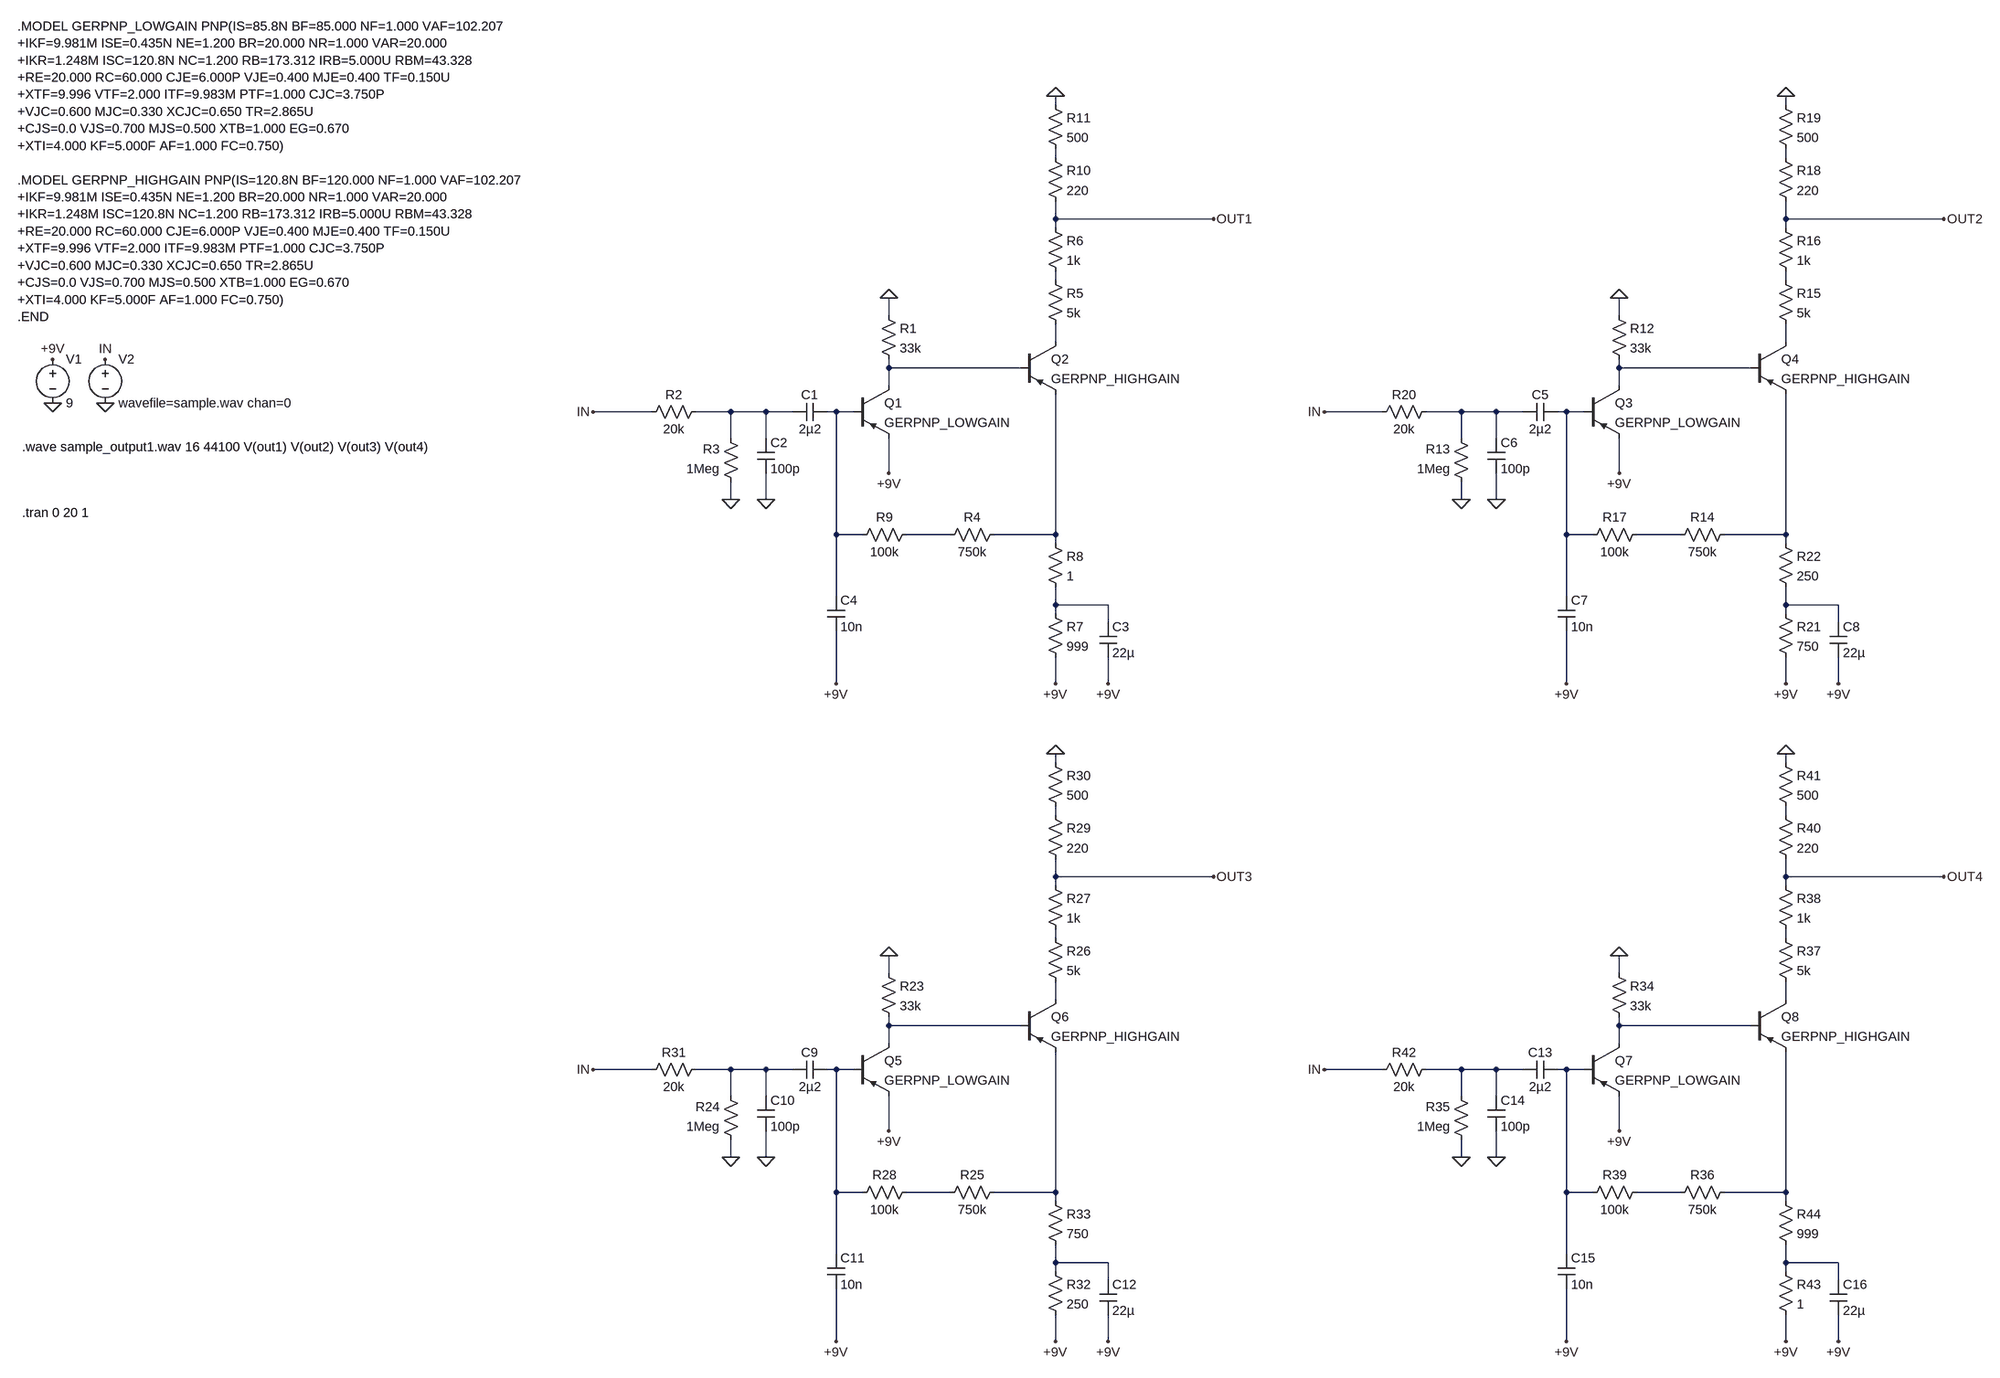
[diagram p0: schematic PNP_Fuzz_Simulation_wav_in_out.asc]
PNP_Fuzz_Simulation_wav_in_out.asc, the LTspice schematic file:
Version 4
SHEET 1 2256 2076
WIRE 496 -320 496 -336
WIRE 1888 -320 1888 -336
WIRE 496 -224 496 -240
WIRE 1888 -224 1888 -240
WIRE 496 -112 496 -144
WIRE 784 -112 496 -112
WIRE 1888 -112 1888 -144
WIRE 2176 -112 1888 -112
WIRE 496 -96 496 -112
WIRE 1888 -96 1888 -112
WIRE 496 0 496 -16
WIRE 1888 0 1888 -16
WIRE 192 64 192 32
WIRE 1584 64 1584 32
WIRE 496 112 496 80
WIRE 1888 112 1888 80
WIRE 192 160 192 144
WIRE 432 160 192 160
WIRE 1584 160 1584 144
WIRE 1824 160 1584 160
WIRE 192 192 192 160
WIRE 1584 192 1584 160
WIRE -240 240 -384 240
WIRE -96 240 -160 240
WIRE -32 240 -96 240
WIRE 16 240 -32 240
WIRE 96 240 80 240
WIRE 128 240 96 240
WIRE 1152 240 1008 240
WIRE 1296 240 1232 240
WIRE 1360 240 1296 240
WIRE 1408 240 1360 240
WIRE 1488 240 1472 240
WIRE 1520 240 1488 240
WIRE -96 288 -96 240
WIRE -32 288 -32 240
WIRE 1296 288 1296 240
WIRE 1360 288 1360 240
WIRE 192 352 192 288
WIRE 1584 352 1584 288
WIRE -96 400 -96 368
WIRE -32 400 -32 352
WIRE 1296 400 1296 368
WIRE 1360 400 1360 352
WIRE 96 464 96 240
WIRE 144 464 96 464
WIRE 304 464 224 464
WIRE 496 464 496 208
WIRE 496 464 384 464
WIRE 1488 464 1488 240
WIRE 1536 464 1488 464
WIRE 1696 464 1616 464
WIRE 1888 464 1888 208
WIRE 1888 464 1776 464
WIRE 496 480 496 464
WIRE 1888 480 1888 464
WIRE 96 576 96 464
WIRE 1488 576 1488 464
WIRE 496 592 496 560
WIRE 592 592 496 592
WIRE 1888 592 1888 560
WIRE 1984 592 1888 592
WIRE 496 608 496 592
WIRE 1888 608 1888 592
WIRE 592 624 592 592
WIRE 1984 624 1984 592
WIRE 96 736 96 640
WIRE 496 736 496 688
WIRE 592 736 592 688
WIRE 1488 736 1488 640
WIRE 1888 736 1888 688
WIRE 1984 736 1984 688
WIRE 496 880 496 864
WIRE 1888 880 1888 864
WIRE 496 976 496 960
WIRE 1888 976 1888 960
WIRE 496 1088 496 1056
WIRE 784 1088 496 1088
WIRE 1888 1088 1888 1056
WIRE 2176 1088 1888 1088
WIRE 496 1104 496 1088
WIRE 1888 1104 1888 1088
WIRE 496 1200 496 1184
WIRE 1888 1200 1888 1184
WIRE 192 1264 192 1232
WIRE 1584 1264 1584 1232
WIRE 496 1312 496 1280
WIRE 1888 1312 1888 1280
WIRE 192 1360 192 1344
WIRE 432 1360 192 1360
WIRE 1584 1360 1584 1344
WIRE 1824 1360 1584 1360
WIRE 192 1392 192 1360
WIRE 1584 1392 1584 1360
WIRE -240 1440 -384 1440
WIRE -96 1440 -160 1440
WIRE -32 1440 -96 1440
WIRE 16 1440 -32 1440
WIRE 96 1440 80 1440
WIRE 128 1440 96 1440
WIRE 1152 1440 1008 1440
WIRE 1296 1440 1232 1440
WIRE 1360 1440 1296 1440
WIRE 1408 1440 1360 1440
WIRE 1488 1440 1472 1440
WIRE 1520 1440 1488 1440
WIRE -96 1488 -96 1440
WIRE -32 1488 -32 1440
WIRE 1296 1488 1296 1440
WIRE 1360 1488 1360 1440
WIRE 192 1552 192 1488
WIRE 1584 1552 1584 1488
WIRE -96 1600 -96 1568
WIRE -32 1600 -32 1552
WIRE 1296 1600 1296 1568
WIRE 1360 1600 1360 1552
WIRE 96 1664 96 1440
WIRE 144 1664 96 1664
WIRE 304 1664 224 1664
WIRE 496 1664 496 1408
WIRE 496 1664 384 1664
WIRE 1488 1664 1488 1440
WIRE 1536 1664 1488 1664
WIRE 1696 1664 1616 1664
WIRE 1888 1664 1888 1408
WIRE 1888 1664 1776 1664
WIRE 496 1680 496 1664
WIRE 1888 1680 1888 1664
WIRE 96 1776 96 1664
WIRE 1488 1776 1488 1664
WIRE 496 1792 496 1760
WIRE 592 1792 496 1792
WIRE 1888 1792 1888 1760
WIRE 1984 1792 1888 1792
WIRE 496 1808 496 1792
WIRE 1888 1808 1888 1792
WIRE 592 1824 592 1792
WIRE 1984 1824 1984 1792
WIRE 96 1936 96 1840
WIRE 496 1936 496 1888
WIRE 592 1936 592 1888
WIRE 1488 1936 1488 1840
WIRE 1888 1936 1888 1888
WIRE 1984 1936 1984 1888
FLAG 192 32 0
FLAG -384 240 IN
FLAG 192 352 +9V
FLAG -96 400 0
FLAG -1648 224 0
FLAG -1552 224 0
FLAG -1648 144 +9V
FLAG -1552 144 IN
FLAG -32 400 0
FLAG 496 736 +9V
FLAG 592 736 +9V
FLAG 784 -112 OUT1
FLAG 496 -336 0
FLAG 96 736 +9V
FLAG 1584 32 0
FLAG 1008 240 IN
FLAG 1584 352 +9V
FLAG 1296 400 0
FLAG 1360 400 0
FLAG 1888 736 +9V
FLAG 1984 736 +9V
FLAG 2176 -112 OUT2
FLAG 1888 -336 0
FLAG 1488 736 +9V
FLAG 192 1232 0
FLAG -384 1440 IN
FLAG 192 1552 +9V
FLAG -96 1600 0
FLAG -32 1600 0
FLAG 496 1936 +9V
FLAG 592 1936 +9V
FLAG 784 1088 OUT3
FLAG 496 864 0
FLAG 96 1936 +9V
FLAG 1584 1232 0
FLAG 1008 1440 IN
FLAG 1584 1552 +9V
FLAG 1296 1600 0
FLAG 1360 1600 0
FLAG 1888 1936 +9V
FLAG 1984 1936 +9V
FLAG 2176 1088 OUT4
FLAG 1888 864 0
FLAG 1488 1936 +9V
SYMBOL res 176 48 R0
SYMATTR InstName R1
SYMATTR Value 33k
SYMBOL res -80 384 R180
WINDOW 0 36 76 Left 2
WINDOW 3 36 40 Left 2
SYMATTR InstName R3
SYMATTR Value 1Meg
SYMBOL voltage -1648 128 R0
WINDOW 123 0 0 Left 0
WINDOW 39 0 0 Left 0
SYMATTR InstName V1
SYMATTR Value 9
SYMBOL voltage -1552 128 R0
WINDOW 123 0 0 Left 0
WINDOW 39 0 0 Left 0
SYMATTR InstName V2
SYMATTR Value wavefile=sample.wav chan=0
SYMBOL pnp 128 192 R0
SYMATTR InstName Q1
SYMATTR Value GERPNP_LOWGAIN
SYMBOL cap 80 224 R90
WINDOW 0 0 32 VBottom 2
WINDOW 3 32 32 VTop 2
SYMATTR InstName C1
SYMATTR Value 2µ2
SYMBOL cap -48 288 R0
SYMATTR InstName C2
SYMATTR Value 100p
SYMBOL res 400 448 R90
WINDOW 0 0 56 VBottom 2
WINDOW 3 32 56 VTop 2
SYMATTR InstName R4
SYMATTR Value 750k
SYMBOL res 480 -16 R0
SYMATTR InstName R5
SYMATTR Value 5k
SYMBOL res 480 -112 R0
SYMATTR InstName R6
SYMATTR Value 1k
SYMBOL res 240 448 R90
WINDOW 0 0 56 VBottom 2
WINDOW 3 32 56 VTop 2
SYMATTR InstName R9
SYMATTR Value 100k
SYMBOL res 480 -240 R0
SYMATTR InstName R10
SYMATTR Value 220
SYMBOL res 480 -336 R0
SYMATTR InstName R11
SYMATTR Value 500
SYMBOL pnp 432 112 R0
SYMATTR InstName Q2
SYMATTR Value GERPNP_HIGHGAIN
SYMBOL res -144 224 R90
WINDOW 0 0 56 VBottom 2
WINDOW 3 32 56 VTop 2
SYMATTR InstName R2
SYMATTR Value 20k
SYMBOL cap 80 576 R0
SYMATTR InstName C4
SYMATTR Value 10n
SYMBOL cap 576 624 R0
SYMATTR InstName C3
SYMATTR Value 22µ
SYMBOL res 480 592 R0
SYMATTR InstName R7
SYMATTR Value 999
SYMBOL res 480 464 R0
SYMATTR InstName R8
SYMATTR Value 1
SYMBOL res 1568 48 R0
SYMATTR InstName R12
SYMATTR Value 33k
SYMBOL res 1312 384 R180
WINDOW 0 36 76 Left 2
WINDOW 3 36 40 Left 2
SYMATTR InstName R13
SYMATTR Value 1Meg
SYMBOL pnp 1520 192 R0
SYMATTR InstName Q3
SYMATTR Value GERPNP_LOWGAIN
SYMBOL cap 1472 224 R90
WINDOW 0 0 32 VBottom 2
WINDOW 3 32 32 VTop 2
SYMATTR InstName C5
SYMATTR Value 2µ2
SYMBOL cap 1344 288 R0
SYMATTR InstName C6
SYMATTR Value 100p
SYMBOL res 1792 448 R90
WINDOW 0 0 56 VBottom 2
WINDOW 3 32 56 VTop 2
SYMATTR InstName R14
SYMATTR Value 750k
SYMBOL res 1872 -16 R0
SYMATTR InstName R15
SYMATTR Value 5k
SYMBOL res 1872 -112 R0
SYMATTR InstName R16
SYMATTR Value 1k
SYMBOL res 1632 448 R90
WINDOW 0 0 56 VBottom 2
WINDOW 3 32 56 VTop 2
SYMATTR InstName R17
SYMATTR Value 100k
SYMBOL res 1872 -240 R0
SYMATTR InstName R18
SYMATTR Value 220
SYMBOL res 1872 -336 R0
SYMATTR InstName R19
SYMATTR Value 500
SYMBOL pnp 1824 112 R0
SYMATTR InstName Q4
SYMATTR Value GERPNP_HIGHGAIN
SYMBOL res 1248 224 R90
WINDOW 0 0 56 VBottom 2
WINDOW 3 32 56 VTop 2
SYMATTR InstName R20
SYMATTR Value 20k
SYMBOL cap 1472 576 R0
SYMATTR InstName C7
SYMATTR Value 10n
SYMBOL cap 1968 624 R0
SYMATTR InstName C8
SYMATTR Value 22µ
SYMBOL res 1872 592 R0
SYMATTR InstName R21
SYMATTR Value 750
SYMBOL res 1872 464 R0
SYMATTR InstName R22
SYMATTR Value 250
SYMBOL res 176 1248 R0
SYMATTR InstName R23
SYMATTR Value 33k
SYMBOL res -80 1584 R180
WINDOW 0 36 76 Left 2
WINDOW 3 36 40 Left 2
SYMATTR InstName R24
SYMATTR Value 1Meg
SYMBOL pnp 128 1392 R0
SYMATTR InstName Q5
SYMATTR Value GERPNP_LOWGAIN
SYMBOL cap 80 1424 R90
WINDOW 0 0 32 VBottom 2
WINDOW 3 32 32 VTop 2
SYMATTR InstName C9
SYMATTR Value 2µ2
SYMBOL cap -48 1488 R0
SYMATTR InstName C10
SYMATTR Value 100p
SYMBOL res 400 1648 R90
WINDOW 0 0 56 VBottom 2
WINDOW 3 32 56 VTop 2
SYMATTR InstName R25
SYMATTR Value 750k
SYMBOL res 480 1184 R0
SYMATTR InstName R26
SYMATTR Value 5k
SYMBOL res 480 1088 R0
SYMATTR InstName R27
SYMATTR Value 1k
SYMBOL res 240 1648 R90
WINDOW 0 0 56 VBottom 2
WINDOW 3 32 56 VTop 2
SYMATTR InstName R28
SYMATTR Value 100k
SYMBOL res 480 960 R0
SYMATTR InstName R29
SYMATTR Value 220
SYMBOL res 480 864 R0
SYMATTR InstName R30
SYMATTR Value 500
SYMBOL pnp 432 1312 R0
SYMATTR InstName Q6
SYMATTR Value GERPNP_HIGHGAIN
SYMBOL res -144 1424 R90
WINDOW 0 0 56 VBottom 2
WINDOW 3 32 56 VTop 2
SYMATTR InstName R31
SYMATTR Value 20k
SYMBOL cap 80 1776 R0
SYMATTR InstName C11
SYMATTR Value 10n
SYMBOL cap 576 1824 R0
SYMATTR InstName C12
SYMATTR Value 22µ
SYMBOL res 480 1792 R0
SYMATTR InstName R32
SYMATTR Value 250
SYMBOL res 480 1664 R0
SYMATTR InstName R33
SYMATTR Value 750
SYMBOL res 1568 1248 R0
SYMATTR InstName R34
SYMATTR Value 33k
SYMBOL res 1312 1584 R180
WINDOW 0 36 76 Left 2
WINDOW 3 36 40 Left 2
SYMATTR InstName R35
SYMATTR Value 1Meg
SYMBOL pnp 1520 1392 R0
SYMATTR InstName Q7
SYMATTR Value GERPNP_LOWGAIN
SYMBOL cap 1472 1424 R90
WINDOW 0 0 32 VBottom 2
WINDOW 3 32 32 VTop 2
SYMATTR InstName C13
SYMATTR Value 2µ2
SYMBOL cap 1344 1488 R0
SYMATTR InstName C14
SYMATTR Value 100p
SYMBOL res 1792 1648 R90
WINDOW 0 0 56 VBottom 2
WINDOW 3 32 56 VTop 2
SYMATTR InstName R36
SYMATTR Value 750k
SYMBOL res 1872 1184 R0
SYMATTR InstName R37
SYMATTR Value 5k
SYMBOL res 1872 1088 R0
SYMATTR InstName R38
SYMATTR Value 1k
SYMBOL res 1632 1648 R90
WINDOW 0 0 56 VBottom 2
WINDOW 3 32 56 VTop 2
SYMATTR InstName R39
SYMATTR Value 100k
SYMBOL res 1872 960 R0
SYMATTR InstName R40
SYMATTR Value 220
SYMBOL res 1872 864 R0
SYMATTR InstName R41
SYMATTR Value 500
SYMBOL pnp 1824 1312 R0
SYMATTR InstName Q8
SYMATTR Value GERPNP_HIGHGAIN
SYMBOL res 1248 1424 R90
WINDOW 0 0 56 VBottom 2
WINDOW 3 32 56 VTop 2
SYMATTR InstName R42
SYMATTR Value 20k
SYMBOL cap 1472 1776 R0
SYMATTR InstName C15
SYMATTR Value 10n
SYMBOL cap 1968 1824 R0
SYMATTR InstName C16
SYMATTR Value 22µ
SYMBOL res 1872 1792 R0
SYMATTR InstName R43
SYMATTR Value 1
SYMBOL res 1872 1664 R0
SYMATTR InstName R44
SYMATTR Value 999
TEXT -1704 424 Left 2 !.tran 0 20 1
TEXT -1704 304 Left 2 !.wave sample_output1.wav 16 44100 V(out1) V(out2) V(out3) V(out4)
TEXT -1712 -464 Left 2 !.MODEL GERPNP_LOWGAIN PNP(IS=85.8N BF=85.000 NF=1.000 VAF=102.207\n+IKF=9.981M ISE=0.435N NE=1.200 BR=20.000 NR=1.000 VAR=20.000\n+IKR=1.248M ISC=120.8N NC=1.200 RB=173.312 IRB=5.000U RBM=43.328\n+RE=20.000 RC=60.000 CJE=6.000P VJE=0.400 MJE=0.400 TF=0.150U\n+XTF=9.996 VTF=2.000 ITF=9.983M PTF=1.000 CJC=3.750P\n+VJC=0.600 MJC=0.330 XCJC=0.650 TR=2.865U\n+CJS=0.0 VJS=0.700 MJS=0.500 XTB=1.000 EG=0.670\n+XTI=4.000 KF=5.000F AF=1.000 FC=0.750)\n \n.MODEL GERPNP_HIGHGAIN PNP(IS=120.8N BF=120.000 NF=1.000 VAF=102.207\n+IKF=9.981M ISE=0.435N NE=1.200 BR=20.000 NR=1.000 VAR=20.000\n+IKR=1.248M ISC=120.8N NC=1.200 RB=173.312 IRB=5.000U RBM=43.328\n+RE=20.000 RC=60.000 CJE=6.000P VJE=0.400 MJE=0.400 TF=0.150U\n+XTF=9.996 VTF=2.000 ITF=9.983M PTF=1.000 CJC=3.750P\n+VJC=0.600 MJC=0.330 XCJC=0.650 TR=2.865U\n+CJS=0.0 VJS=0.700 MJS=0.500 XTB=1.000 EG=0.670\n+XTI=4.000 KF=5.000F AF=1.000 FC=0.750)\n.END

The netlist it stands for:
* PNP_Fuzz_Simulation_wav_in_out.asc
R1 0 N007 33k
R3 0 N009 1Meg
V1 +9V 0 9
V2 IN 0 wavefile=sample.wav chan=0
Q1 N007 N010 +9V 0 GERPNP_LOWGAIN
C1 N010 N009 2µ2
C2 N009 0 100p
R4 N014 N013 750k
R5 N003 N005 5k
R6 OUT1 N003 1k
R9 N013 N010 100k
R10 N001 OUT1 220
R11 0 N001 500
Q2 N005 N007 N014 0 GERPNP_HIGHGAIN
R2 N009 IN 20k
C4 N010 +9V 10n
C3 N017 +9V 22µ
R7 N017 +9V 999
R8 N014 N017 1
R12 0 N008 33k
R13 0 N011 1Meg
Q3 N008 N012 +9V 0 GERPNP_LOWGAIN
C5 N012 N011 2µ2
C6 N011 0 100p
R14 N016 N015 750k
R15 N004 N006 5k
R16 OUT2 N004 1k
R17 N015 N012 100k
R18 N002 OUT2 220
R19 0 N002 500
Q4 N006 N008 N016 0 GERPNP_HIGHGAIN
R20 N011 IN 20k
C7 N012 +9V 10n
C8 N018 +9V 22µ
R21 N018 +9V 750
R22 N016 N018 250
R23 0 N025 33k
R24 0 N027 1Meg
Q5 N025 N028 +9V 0 GERPNP_LOWGAIN
C9 N028 N027 2µ2
C10 N027 0 100p
R25 N032 N031 750k
R26 N021 N023 5k
R27 OUT3 N021 1k
R28 N031 N028 100k
R29 N019 OUT3 220
R30 0 N019 500
Q6 N023 N025 N032 0 GERPNP_HIGHGAIN
R31 N027 IN 20k
C11 N028 +9V 10n
C12 N035 +9V 22µ
R32 N035 +9V 250
R33 N032 N035 750
R34 0 N026 33k
R35 0 N029 1Meg
Q7 N026 N030 +9V 0 GERPNP_LOWGAIN
C13 N030 N029 2µ2
C14 N029 0 100p
R36 N034 N033 750k
R37 N022 N024 5k
R38 OUT4 N022 1k
R39 N033 N030 100k
R40 N020 OUT4 220
R41 0 N020 500
Q8 N024 N026 N034 0 GERPNP_HIGHGAIN
R42 N029 IN 20k
C15 N030 +9V 10n
C16 N036 +9V 22µ
R43 N036 +9V 1
R44 N034 N036 999
.model NPN NPN
.model PNP PNP
.lib standard.bjt
.tran 0 20 1
.wave sample_output1.wav 16 44100 V(out1) V(out2) V(out3) V(out4)
.MODEL GERPNP_LOWGAIN PNP(IS=85.8N BF=85.000 NF=1.000 VAF=102.207
+IKF=9.981M ISE=0.435N NE=1.200 BR=20.000 NR=1.000 VAR=20.000
+IKR=1.248M ISC=120.8N NC=1.200 RB=173.312 IRB=5.000U RBM=43.328
+RE=20.000 RC=60.000 CJE=6.000P VJE=0.400 MJE=0.400 TF=0.150U
+XTF=9.996 VTF=2.000 ITF=9.983M PTF=1.000 CJC=3.750P
+VJC=0.600 MJC=0.330 XCJC=0.650 TR=2.865U
+CJS=0.0 VJS=0.700 MJS=0.500 XTB=1.000 EG=0.670
+XTI=4.000 KF=5.000F AF=1.000 FC=0.750)
.MODEL GERPNP_HIGHGAIN PNP(IS=120.8N BF=120.000 NF=1.000 VAF=102.207
+IKF=9.981M ISE=0.435N NE=1.200 BR=20.000 NR=1.000 VAR=20.000
+IKR=1.248M ISC=120.8N NC=1.200 RB=173.312 IRB=5.000U RBM=43.328
+RE=20.000 RC=60.000 CJE=6.000P VJE=0.400 MJE=0.400 TF=0.150U
+XTF=9.996 VTF=2.000 ITF=9.983M PTF=1.000 CJC=3.750P
+VJC=0.600 MJC=0.330 XCJC=0.650 TR=2.865U
+CJS=0.0 VJS=0.700 MJS=0.500 XTB=1.000 EG=0.670
+XTI=4.000 KF=5.000F AF=1.000 FC=0.750)
.END
.backanno
.end